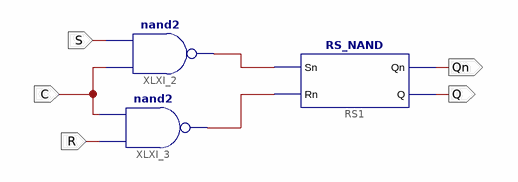
[diagram p0: schematic sheet 1]
// Xilinx ISE schematic RS_EN.sch (kintex7) as structural Verilog: 3 symbols, 5 ports
module RS_EN (
  input  C,
  input  S,
  input  R,
  output Qn,
  output Q
);

  wire XLXN_1, XLXN_2;

  RS_NAND RS1 (.Sn(XLXN_1), .Rn(XLXN_2), .Qn(Qn), .Q(Q));
  nand XLXI_2 (XLXN_1, C, S);
  nand XLXI_3 (XLXN_2, R, C);
endmodule
